# Altium schematic sheet Peripherals.SchDoc
size A; SheetNumber: 3; SheetTotal: 4
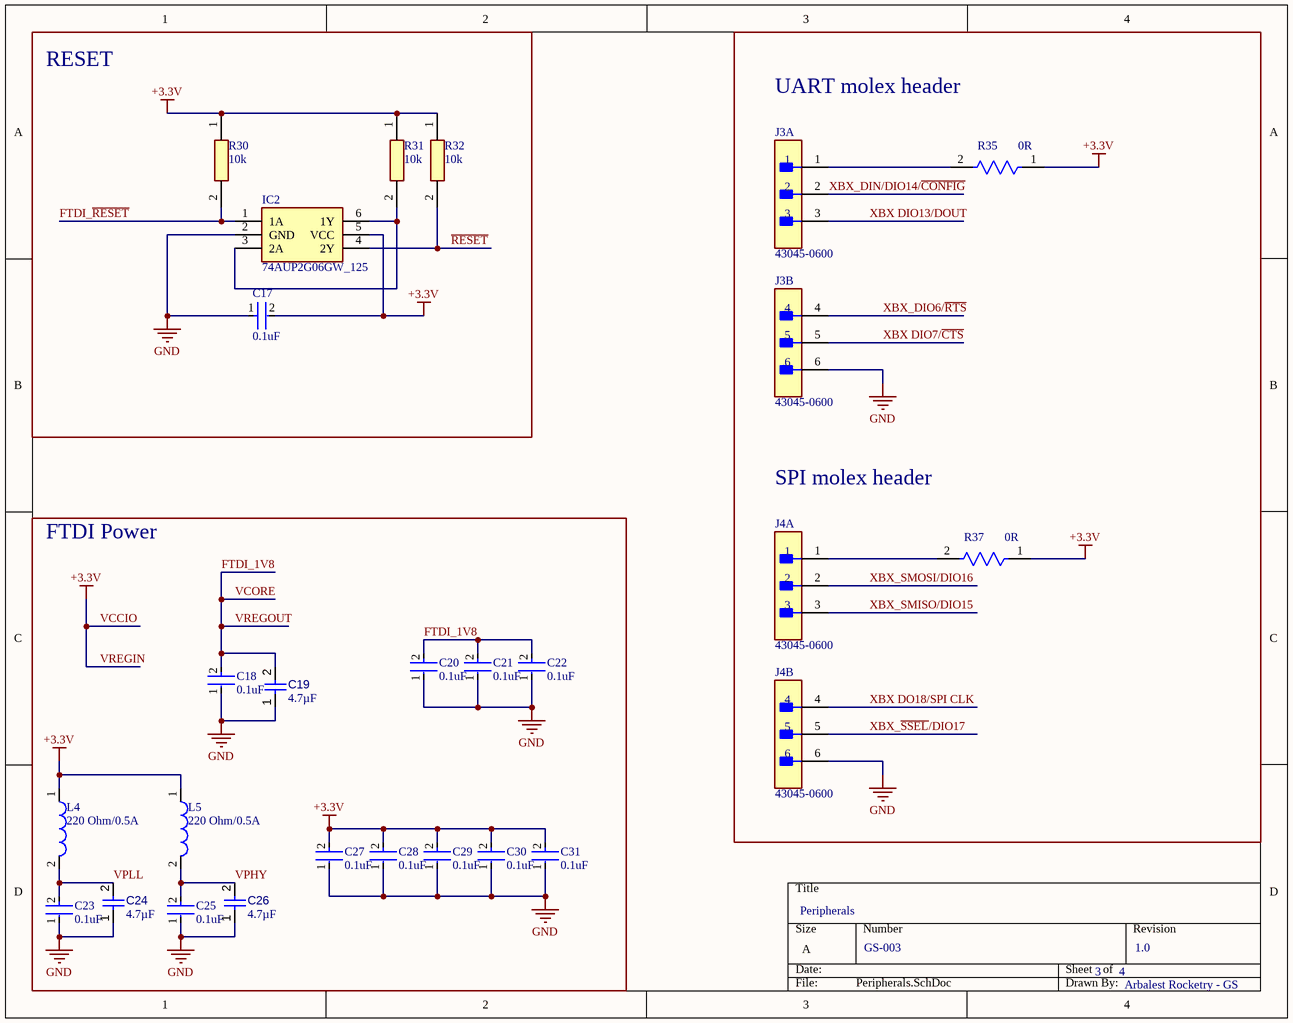
[diagram p0: Peripherals.SchDoc]

## Parts
C17  0.1uF  [FP-CGA3E-0_3-0_1-IPC_A]
C18  0.1uF  [FP-GCJ188-0_2-IPC_C]
C19  value 4.7µF  [CAPC0603(1608)100_L]  (hidden comment: Capacitor 4.7µF +/-20% 10V 0603)
C20  0.1uF  [FP-GCJ188-0_2-IPC_C]
C21  0.1uF  [FP-GCJ188-0_2-IPC_C]
C22  0.1uF  [FP-GCJ188-0_2-IPC_C]
C23  0.1uF  [FP-GCJ188-0_2-IPC_C]
C24  value 4.7µF  [CAPC0603(1608)100_L]  (hidden comment: Capacitor 4.7µF +/-20% 10V 0603)
C25  0.1uF  [FP-GCJ188-0_2-IPC_C]
C26  value 4.7µF  [CAPC0603(1608)100_L]  (hidden comment: Capacitor 4.7µF +/-20% 10V 0603)
C27  0.1uF  [FP-GCJ188-0_2-IPC_C]
C28  0.1uF  [FP-GCJ188-0_2-IPC_C]
C29  0.1uF  [FP-GCJ188-0_2-IPC_C]
C30  0.1uF  [FP-GCJ188-0_2-IPC_C]
C31  0.1uF  [FP-GCJ188-0_2-IPC_C]
IC2  74AUP2G06GW_125  [SOT65P210X110-6N]
J3  43045-0600  [FP-0430450600-MFG]  (parts A,B of 2)
J4  43045-0600  [FP-0430450600-MFG]  (parts A,B of 2)
L4  220 Ohm/0.5A  [SMD-0603]
L5  220 Ohm/0.5A  [SMD-0603]
R30  10k  [RESC1608X55N]
R31  10k  [RESC1608X55N]
R32  10k  [RESC1608X55N]
R35  0R  [FP-ERJ-3GEY0R00V-MFG]
R37  0R  [FP-ERJ-3GEY0R00V-MFG]

## Blocks framed on the sheet
RESET: C17 IC2 R30-R32
FTDI Power: C18-C31 L4 L5

## Nets
GND: C17.1 C18.1 C19.1 C20.1 C21.1 C22.1 C23.1 C24.1 C25.1 C26.1 C27.1 C28.1 C29.1 C30.1 C31.1 IC2.2(GND) J3.6 J4.6
VCCIO: C17.2 C27.2 C28.2 C29.2 C30.2 C31.2 IC2.5(VCC) L4.1 L5.1 R30.1 R31.1 R32.1 R35.1 R37.1  [also labelled +3.3V, VREGIN]
FTDI_1V8: C18.2 C19.2 C20.2 C21.2 C22.2  [also labelled VCORE, VREGOUT]
FTDI_~{RESET}: IC2.1(1A) R30.2
~{RESET}: IC2.4(2Y) R32.2
VPHY: C25.2 C26.2 L5.2
VPLL: C23.2 C24.2 L4.2
XBX DIO7/~{CTS}: J3.5
XBX DIO13/DOUT: J3.3
XBX DO18/SPI CLK: J4.4
XBX_DIN/DIO14/~{CONFIG}: J3.2
XBX_DIO6/~{RTS}: J3.4
XBX_~{SSEL}/DIO17: J4.5
XBX_SMISO/DIO15: J4.3
XBX_SMOSI/DIO16: J4.2
NetIC2_3: IC2.3(2A) IC2.6(1Y) R31.2
NetJ3_1: J3.1 R35.2
NetJ4_1: J4.1 R37.2

## Notes on the sheet
- UART molex header
- SPI molex header
- Peripherals
- GS-003
- 3
- 4
- 1.0
- Arbalest Rocketry - GS

## Library data of the parts
C17 = CMP-08246-001708-1: Cap Ceramic 100nF 50V X7R 20% Pad SMD 0603 +125°C Automotive T/R; Voltage Rating: 50V; Width: 0.031inch; Height: 0.8mm; Capacitance: 100nF; Case Code (Metric): 1608; Packaging: Tape and Reel; Mount: Surface Mount; Weight: 7.1E-05oz; Max Operating Temperature: 125°C; Min Operating Temperature: -55°C; Voltage Rating (DC): 50V; Ratings: AEC-Q200; Dielectric: X7R; Case Code (Imperial): 0603; Package Quantity: 4000; Length: 0.063inch; Tolerance: 20%; Thickness: 0.031inch; Case/Package: 0603
C18 C20-C23 C25 C27-C31 = CMP-06035-054388-1: Cap Ceramic 0.1uF 50V X8R 10% Pad SMD 0603 Soft Termination +150°C Automotive T/R
C19 C24 C26 = CMP-001-00076-4: Chip Capacitor, 4.7µF +/-20%, 10V, 0603, Thickness 1 mm; Tolerance: 10%; Mounting Technology: SMT; Case/Package: 0603; Pins: 2; Min Operating Temperature: -55°C; Max Operating Temperature: 85°C; Voltage Rating: 10V
IC2 = CMP-159-000000-1: 74AUP2G06 - Low-power dual inverter with open-drain output@en-us; Manufacturer_Name: Nexperia; Manufacturer_Part_Number: 74AUP2G06GW,125; Geometry.Height: 1.1mm; Source: 74AUP2G06GW_125.SchLib; Mouser Part Number: 771-74AUP2G06GW125; Mouser Price/Stock: https://www.mouser.co.uk/ProductDetail/Nexperia/74AUP2G06GW125?qs=jquClx72t9AZXxLJ%252BWUccA%3D%3D; Arrow Part Number: *; Datasheet Link: https://assets.nexperia.com/documents/data-sheet/74AUP2G06.pdf; Arrow Price/Stock: *; Design Item ID: 74AUP2G06GW_125
J3 J4 = CMP-00257-00287064-1: 43045-0600 Connector Wire to Board Header 6 Position 3mm Solder Right Angle Thru-Hole Tray; NexarPartId: 287064; Manufacturer Lifecycle Status: ACTIVE; Max Current Rating: 5A; Voltage Rating (AC): 250V; Number of Positions: 6; Insulation Resistance: 1GΩ; Glow Wire Compliant: Compliant; Approvals: CSA, TUV, UL; Max Voltage Rating (DC): 250.25kV; Contact Resistance: 10mΩ; Plating: Tin; Gender: Male; Radiation Hardening: No; Number of Rows: 2; Lifecycle Status: Production; Row Spacing: 3mm; Orientation: Right Angle, Vertical; Housing Material: Thermoplastic; Diameter: 3mm; Termination: Solder; Height: 7.37mm; Min Operating Temperature: -40°C; Max Operating Temperature: 105°C; Depth: 12.2mm; Pitch: 3mm; Length: 12.6mm; Current Rating: 5A; Lead Free: Lead Free; Voltage Rating: 250V; Housing Color: Black; Mount: Through Hole; Number of Circuits: 6; Contact Plating: Tin; Country of Origin: US; Flammability Rating: UL94 V-0; RoHS: Compliant; Contact Material: Brass, Tin; Color: Black; Width: 9.9mm; Voltage Rating (DC): 250V; Lead Pitch: 3mm; Case/Package: SMC; REACH SVHC: No SVHC; Schedule B: 8536694040; Packaging: Bulk; Number of Pins: 6; Halogen Free: Low Halogen; Number of Contacts: 6; Material: Polyester
L4 L5 = CMP-0220-00148-1: SMD EMI Suppression Ferrite Bead WE-CBF, Z = 220 Ohm; Impedance: 220 Ohm; PackageVersion: 2009; ComponentLink2URL: http://www.we-online.de/katalog/media/pdf/74279263.pdf; PackageDescription: Chip Inductor, 2-Leads, Body 1.6 x 0.8 mm; PackageReference: SMD-0603; ComponentLink1URL: http://www.we-online.com; ComponentLink2Description: Datasheet; ComponentLink1Description: Manufacturer Link; DatasheetVersion: Dec-2005
R30-R32 = CR0603-FX-1002ELF: Resistor; Manufacturer_Name: Bourns; Datasheet Link: https://www.bourns.com/pdfs/chpreztr.pdf; Height: 0.55mm; Manufacturer_Part_Number: CR0603-FX-1002ELF; Mouser Part Number: 652-CR0603FX-1002ELF; Mouser Price/Stock: https://www.mouser.co.uk/ProductDetail/Bourns/CR0603-FX-1002ELF?qs=K5ddiUFZPT6XHG0dQH96QA%3D%3D; Arrow Part Number: CR0603-FX-1002ELF; Arrow Price/Stock: https://www.arrow.com/en/products/cr0603-fx-1002elf/bourns?utm_currency=USD&region=europe
R35 R37 = CMP-2000-00700-2: RES SMD 0 OHM JUMPER 1/10W 0603; Manufacturer Part Number: ERJ-3GEY0R00V; Manufacturer: Panasonic; Tolerance: 5%; Automotive Grade: Grade 0; Voltage Rating: 75V; Value: 0Ω; Temperature Coefficient: -100/+600ppm/°C; Power Rating: 0.1W; Mouser Description: Resistor, Chip Thick Film, 0 Ohm, 0.1w, Resistor, Chip Thick Film, 0 Ohm, 0.1w, 5%; Ipc Land Pattern Name: RESC16080X45; Category: Res; Package: 0603; Temperature: -55°C to +155°C; Temperature Range Low: -55°C; Series: ERJ; Resistance: 0Ω; RoHS: TRUE; Composition: Thick Film; Octopart: https://octopart.com/erj-3gey0r00v-panasonic-55389238; Device Class L1: Passive Components; Footprint Url: https://industrial.panasonic.com/cdbs/www-data/pdf/RDA0000/DMA0000COL17.pdf; ComponentLink2Description: Datasheet; Device Class L2: Resistors; Temperature Range High: +155°C; Digikey Description: RES SMD 0 OHM JUMPER 1/10W 0603; Lead Free: Yes; Device Class L3: Chip SMD Resistors; Height: 0.55mm; ComponentLink2URL: https://industrial.panasonic.com/cdbs/www-data/pdf/RDA0000/AOA0000C301.pdf; Automotive: Yes